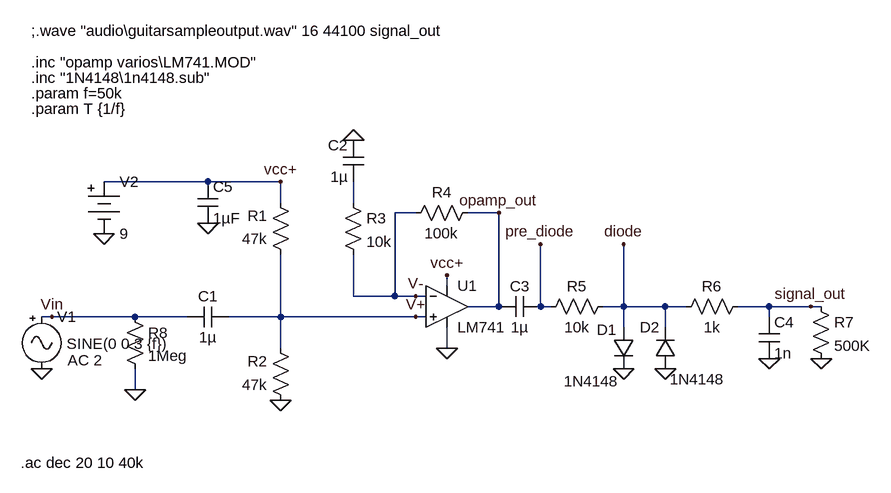
[diagram p0: schematic punto 5.asc]
punto 5.asc, the LTspice schematic file:
Version 4
SHEET 1 1692 680
WIRE -288 -80 -448 -80
WIRE -176 -80 -288 -80
WIRE -176 -48 -176 -80
WIRE -64 -48 -64 -80
WIRE 32 -32 0 -32
WIRE 160 -32 112 -32
WIRE 80 80 80 64
WIRE -64 96 -64 32
WIRE 0 96 0 -32
WIRE 0 96 -64 96
WIRE 32 96 0 96
WIRE 48 96 32 96
WIRE 160 112 160 -32
WIRE 160 112 112 112
WIRE 224 112 224 16
WIRE 240 112 224 112
WIRE 352 112 352 16
WIRE 352 112 320 112
WIRE 416 112 352 112
WIRE 448 112 416 112
WIRE 576 112 528 112
WIRE 640 112 576 112
WIRE 656 112 640 112
WIRE -528 128 -544 128
WIRE -400 128 -528 128
WIRE -320 128 -400 128
WIRE -176 128 -176 32
WIRE -176 128 -256 128
WIRE 32 128 -176 128
WIRE 48 128 32 128
WIRE 576 128 576 112
WIRE 352 144 352 112
WIRE 416 144 416 112
WIRE -176 176 -176 128
WIRE 80 176 80 144
WIRE -400 240 -400 208
FLAG 32 128 V+
FLAG 32 96 V-
FLAG -64 -144 0
FLAG 352 208 0
FLAG 416 208 0
FLAG 576 192 0
FLAG 80 176 0
FLAG -176 256 0
FLAG 656 192 0
FLAG -288 -16 0
FLAG -400 240 0
FLAG -544 208 0
FLAG -448 0 0
FLAG 640 112 signal_out
FLAG -528 128 Vin
FLAG -176 -80 vcc+
FLAG 80 64 vcc+
FLAG 160 -32 opamp_out
FLAG 352 16 diode
FLAG 224 16 pre_diode
DATAFLAG -224 -80 ""
DATAFLAG -176 112 ""
SYMBOL res -160 48 R180
WINDOW 0 36 76 Left 2
WINDOW 3 36 40 Left 2
SYMATTR InstName R1
SYMATTR Value 47k
SYMBOL res -160 272 R180
WINDOW 0 36 76 Left 2
WINDOW 3 36 40 Left 2
SYMATTR InstName R2
SYMATTR Value 47k
SYMBOL res -80 -64 R0
SYMATTR InstName R3
SYMATTR Value 10k
SYMBOL res 128 -48 R90
WINDOW 0 0 56 VBottom 2
WINDOW 3 32 56 VTop 2
SYMATTR InstName R4
SYMATTR Value 100k
SYMBOL res 336 96 R90
WINDOW 0 0 56 VBottom 2
WINDOW 3 32 56 VTop 2
SYMATTR InstName R5
SYMATTR Value 10k
SYMBOL cap -256 112 R90
WINDOW 0 0 32 VBottom 2
WINDOW 3 32 32 VTop 2
SYMATTR InstName C1
SYMATTR Value 1µ
SYMBOL cap -48 -80 R180
WINDOW 0 24 56 Left 2
WINDOW 3 24 8 Left 2
SYMATTR InstName C2
SYMATTR Value 1µ
SYMBOL cap 160 128 R270
WINDOW 0 32 32 VTop 2
WINDOW 3 0 32 VBottom 2
SYMATTR InstName C3
SYMATTR Value 1µ
SYMBOL res 544 96 R90
WINDOW 0 0 56 VBottom 2
WINDOW 3 32 56 VTop 2
SYMATTR InstName R6
SYMATTR Value 1k
SYMBOL cap 560 128 R0
SYMATTR InstName C4
SYMATTR Value 1n
SYMBOL diode 336 144 R0
WINDOW 0 -25 4 Left 2
WINDOW 3 87 80 Left 2
SYMATTR InstName D1
SYMATTR Value 1N4148
SYMBOL diode 432 208 R180
WINDOW 0 24 64 Left 2
WINDOW 3 87 -19 Left 2
SYMATTR InstName D2
SYMATTR Value 1N4148
SYMBOL res 640 96 R0
SYMATTR InstName R7
SYMATTR Value 500K
SYMBOL res -416 112 R0
SYMATTR InstName R8
SYMATTR Value 1Meg
SYMBOL cap -304 -80 R0
SYMATTR InstName C5
SYMATTR Value 1µF
SYMBOL Misc\\battery -448 -96 R0
WINDOW 123 0 0 Left 2
WINDOW 39 0 0 Left 2
SYMATTR InstName V2
SYMATTR Value 9
SYMBOL Misc\\signal -544 112 R0
WINDOW 123 40 83 Left 2
WINDOW 39 0 0 Left 2
WINDOW 3 39 57 Left 2
SYMATTR Value2 AC 2
SYMATTR Value SINE(0 0.3 {f})
SYMATTR InstName V1
SYMBOL Opamps\\opamp2 80 48 R0
SYMATTR InstName U1
SYMATTR Value LM741
TEXT -560 -264 Left 2 !.inc "opamp varios\\LM741.MOD"
TEXT -560 -240 Left 2 !.inc "1N4148\\1n4148.sub"
TEXT -576 352 Left 2 !.ac dec 20 10 40k
TEXT -560 -312 Left 2 !;.wave "audio\\guitarsampleoutput.wav" 16 44100 signal_out
TEXT -560 -216 Left 2 !.param f=50k
TEXT -560 -192 Left 2 !.param T {1/f}

The netlist it stands for:
* punto 5.asc
R1 V+ vcc+ 47k
R2 0 V+ 47k
R3 N001 V- 10k
R4 opamp_out V- 100k
R5 diode pre_diode 10k
C1 V+ Vin 1µ
C2 N001 0 1µ
C3 opamp_out pre_diode 1µ
R6 signal_out diode 1k
C4 signal_out 0 1n
D1 diode 0 1N4148
D2 0 diode 1N4148
R7 signal_out 0 500K
R8 Vin 0 1Meg
C5 vcc+ 0 1µF
V2 vcc+ 0 9
V1 Vin 0 SINE(0 0.3 {f}) AC 2
XU1 V+ V- vcc+ 0 opamp_out LM741  ; pins In+ In- V+ V- OUT
.model D D
.lib standard.dio
.inc "opamp varios\LM741.MOD"
.inc "1N4148\1n4148.sub"
.ac dec 20 10 40k
;.wave "audio\guitarsampleoutput.wav" 16 44100 signal_out
.param f=50k
.param T {1/f}
.backanno
.end